# Altium project 3s2p battery pack.PrjPcb
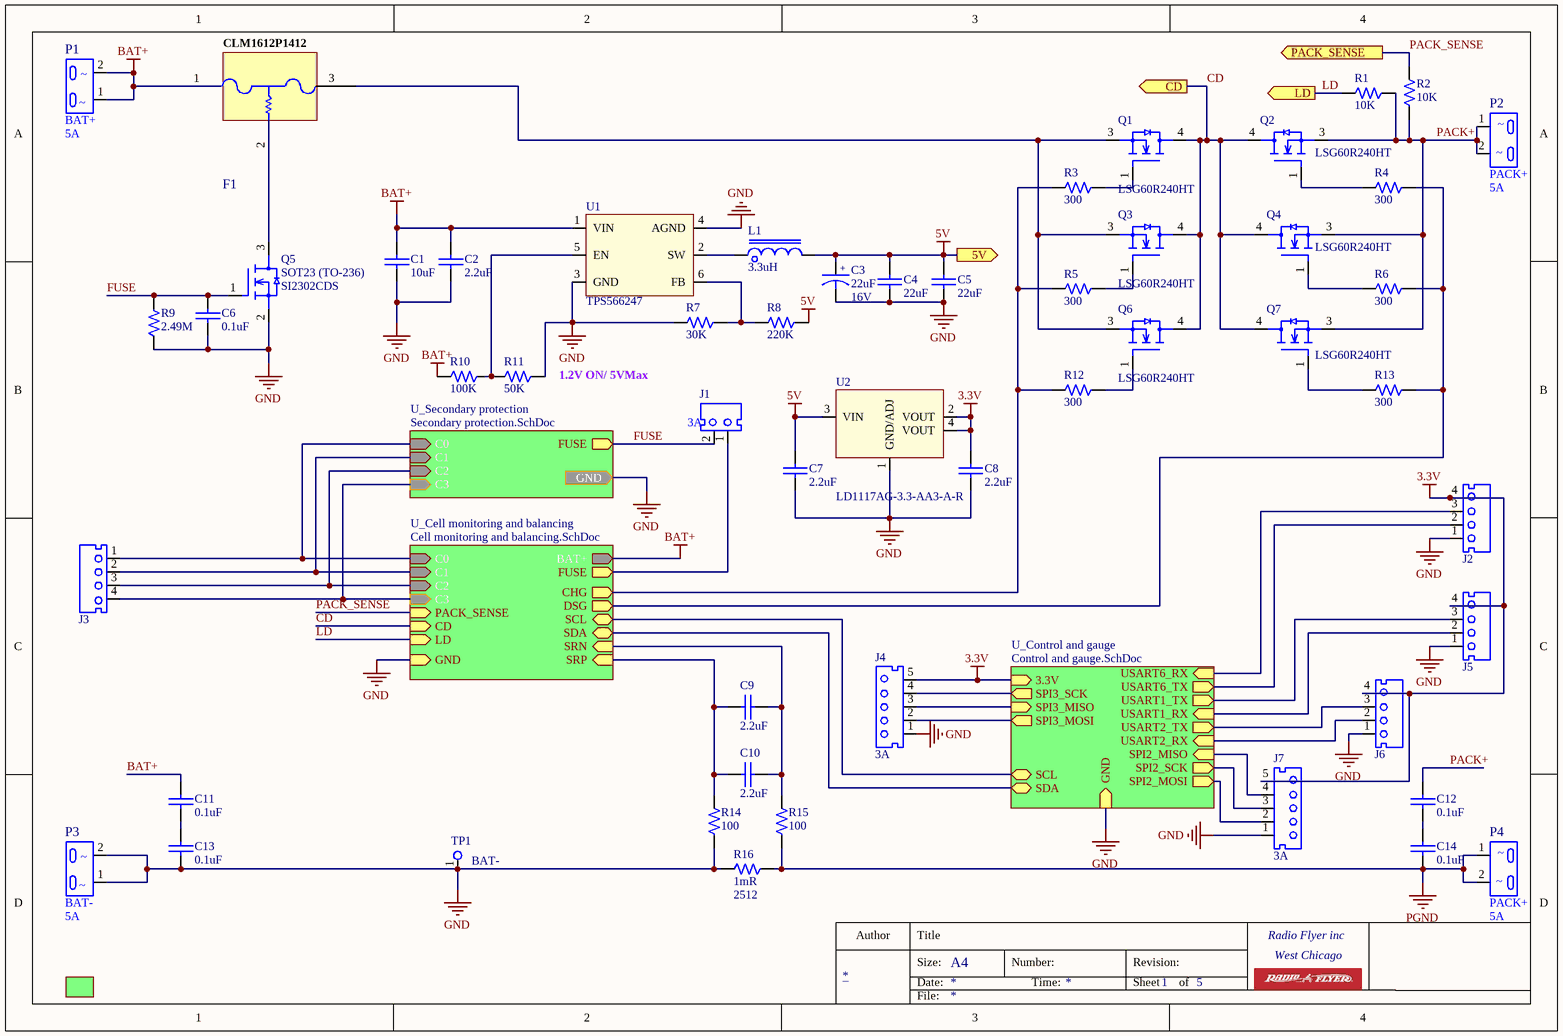
[diagram p0: Overview.SchDoc]
5 sheets, 112 parts. Net scope: hierarchical (ports join the sheet entries above them; power ports are global).
Board file: 3s2p battery pack.PcbDoc
Sheets:
  Overview.SchDoc
    U_Secondary protection = Secondary protection.SchDoc
    U_Cell monitoring and balancing = Cell monitoring and balancing.SchDoc
    U_Control and gauge = Control and gauge.SchDoc
    U_Main board frame = Main board frame.SchDoc

## Sheet Overview.SchDoc
size A4; Organization: Altium Limited; Address1: L3, 12a Rodborough Rd; Address2: Frenchs Forest; Address3: NSW; Address4: Australia 2086; SheetNumber: 1; SheetTotal: 5

### Parts
C1  value 10uF  [CAPC0603-RW]  (hidden comment: T542021037308)
C2  value 2.2uF  [CAPC0603-RW]  (hidden comment: T542021037308)
C3  value 22uF  Voltage: 16V  [CASE - B]  (hidden comment: T551220435010)
C4  value 22uF  [CAPC0603-RW]  (hidden comment: T542021037308)
C5  value 22uF  [CAPC0603-RW]  (hidden comment: T542021037308)
C6  value 0.1uF  [CAPC0603-RW]  (hidden comment: T542021037308)
C7  value 2.2uF  [CAPC0603-RW]  (hidden comment: T542021037308)
C8  value 2.2uF  [CAPC0603-RW]  (hidden comment: T542021037308)
C9  value 2.2uF  [CAPC0603-RW]  (hidden comment: T542021037308)
C10  value 2.2uF  [CAPC0603-RW]  (hidden comment: T542021037308)
C11  value 0.1uF  [CAPC0603-RW]  (hidden comment: T542021037308)
C12  value 0.1uF  [CAPC0603-RW]  (hidden comment: T542021037308)
C13  value 0.1uF  [CAPC0603-RW]  (hidden comment: T542021037308)
C14  value 0.1uF  [CAPC0603-RW]  (hidden comment: T542021037308)
F1  KED500004-0010  [CLM1612P1412]  (value not drawn)
J1  Current: 3A  [CONN 2P PH=2.5mm B2B-XH-A]  (hidden comment: CCN250000-0102)
J2  T690300164400  [CONN 4P PH=2.5mm 440052-4]  (value not drawn)
J3  T690300164400  [CONN 4P PH=2.5mm 440052-4]  (value not drawn)
J4  Current: 3A  [CONN 5P PH=2.5mm Molex 99-99-0989]  (hidden comment: CCN250001-0105)
J5  T690300164400  [CONN 4P PH=2.5mm 440052-4]  (value not drawn)
J6  T690300164400  [CONN 4P PH=2.5mm 440052-4]  (value not drawn)
J7  Current: 3A  [CONN 5P PH=2.5mm Molex 99-99-0989]  (hidden comment: CCN250001-0105)
L1  value 3.3uH  [IND  CKST0603]  (hidden comment: T621000080700)
P1  MFG Part: BAT+  Current: 5A  [AC INLET 2P DB8-6S1]  (hidden comment: CJP012009-0070)
P2  MFG Part: PACK+  Current: 5A  [AC INLET 2P DB8-6S1]  (hidden comment: CJP012009-0070)
P3  MFG Part: BAT-  Current: 5A  [AC INLET 2P DB8-6S1]  (hidden comment: CJP012009-0070)
P4  MFG Part: PACK+  Current: 5A  [AC INLET 2P DB8-6S1]  (hidden comment: CJP012009-0070)
Q1  MFG Part: LSG60R240HT  [TO252-3]  (hidden comment: T5860038503A6)
Q2  MFG Part: LSG60R240HT  [TO252-3]  (hidden comment: T5860038503A6)
Q3  MFG Part: LSG60R240HT  [TO252-3]  (hidden comment: T5860038503A6)
Q4  MFG Part: LSG60R240HT  [TO252-3]  (hidden comment: T5860038503A6)
Q5  Package: SOT23 (TO-236)  [SOT23-132-RW]  (hidden comment: SI2302CDS)
Q6  MFG Part: LSG60R240HT  [TO252-3]  (hidden comment: T5860038503A6)
Q7  MFG Part: LSG60R240HT  [TO252-3]  (hidden comment: T5860038503A6)
R1  value 10K  [0603-RW]  (hidden comment: T502976002399)
R2  value 10K  [0603-RW]  (hidden comment: T502976002399)
R3  value 300  [0603-RW]  (hidden comment: T502976002399)
R4  value 300  [0603-RW]  (hidden comment: T502976002399)
R5  value 300  [0603-RW]  (hidden comment: T502976002399)
R6  value 300  [0603-RW]  (hidden comment: T502976002399)
R7  value 30K  [0603-RW]  (hidden comment: T502976002399)
R8  value 220K  [0603-RW]  (hidden comment: T502976002399)
R9  value 2.49M  [0603-RW]  (hidden comment: T502976002399)
R10  value 100K  [0603-RW]  (hidden comment: T502976002399)
R11  value 50K  [0603-RW]  (hidden comment: T502976002399)
R12  value 300  [0603-RW]  (hidden comment: T502976002399)
R13  value 300  [0603-RW]  (hidden comment: T502976002399)
R14  value 100  [0603-RW]  (hidden comment: T502976002399)
R15  value 100  [0603-RW]  (hidden comment: T502976002399)
R16  value 1mR  [2512]  (hidden comment: QCF101250-1009)
TP1  BAT-  [RT-01T-1.0B]
U1  MFG Part: TPS566247  [SOT-563]  (hidden comment: CD1053GTF-Z)
U2  MFG Part: LD1117AG-3.3-AA3-A-R  [SOT223]  (hidden comment: T610600036508)

### Sub-sheets
U_Cell monitoring and balancing = Cell monitoring and balancing.SchDoc: BAT+ (out), C0 (in), C1 (in), C2 (in), C3 (in), PACK_SENSE (in), CD (in), FUSE (out), LD (in), SDA (bidir), SCL (bidir), CHG (out), DSG (out), SRN (in), SRP (in), GND (in)
U_Control and gauge = Control and gauge.SchDoc: SDA (bidir), SCL (bidir), 3.3V (in), USART6_RX (in), USART6_TX (out), USART1_TX (out), USART1_RX (in), SPI3_SCK (out), SPI3_MISO (in), USART2_RX (in), SPI3_MOSI (out), USART2_TX (out), SPI2_SCK (out), SPI2_MOSI (out), SPI2_MISO (in), GND (in)
U_Main board frame = Main board frame.SchDoc: no entries
U_Secondary protection = Secondary protection.SchDoc: C0 (in), C1 (in), C2 (in), C3 (in), FUSE (out)

### Ports
5V (out), CD (out), GND (in), LD (out), PACK_SENSE (out)

### Nets
3.3V: C8.1 J2.4 J4.5 J5.4 J6.4 J7.5 U2.2(VOUT) U2.4(VOUT) ; sheet U_Control and gauge/3.3V
5V: C3.1 C4.1 C5.1 C7.1 L1.2 R8.1 U2.3(VIN) ; port 5V
BAT+: C1.1 C2.1 C11.1 F1.1 J3.4 P1.1 P1.2 R10.2 U1.1(VIN) ; sheet U_Secondary protection/C3, sheet U_Cell monitoring and balancing/BAT+, sheet U_Cell monitoring and balancing/C3
GND: C1.2 C2.2 C3.2 C4.2 C5.2 C6.2 C7.2 C8.2 C13.2 J2.1 J3.1 J4.1 J5.1 J6.1 J7.1 P3.1 P3.2 Q5.2(S) R7.2 R9.2 R11.1 R14.1 R16.2 TP1.1 U1.3(GND) U1.4(AGND) U2.1(GND/ADJ) ; port GND, sheet U_Secondary protection/C0, sheet U_Cell monitoring and balancing/C0, sheet U_Cell monitoring and balancing/GND, sheet U_Control and gauge/GND
PGND: C14.2 P4.1 P4.2 R15.1 R16.1
CD: Q1.4(D) Q2.4(D) Q3.4(D) Q4.4(D) Q6.4(D) Q7.4(D) ; port CD, sheet U_Cell monitoring and balancing/CD
FUSE: C6.1 J1.2 Q5.1(G) R9.1 ; sheet U_Secondary protection/FUSE
LD: R1.2 ; port LD, sheet U_Cell monitoring and balancing/LD
PACK+: C12.1 P2.1 P2.2 Q2.3(S) Q4.3(S) Q7.3(S) R1.1 R2.1
PACK_SENSE: R2.2 ; port PACK_SENSE, sheet U_Cell monitoring and balancing/PACK_SENSE
NetC9_1: C9.1 C10.1 R15.2 ; sheet U_Cell monitoring and balancing/SRN
NetC9_2: C9.2 C10.2 R14.2 ; sheet U_Cell monitoring and balancing/SRP
NetC11_2: C11.2 C13.1
NetC12_2: C12.2 C14.1
NetF1_2: F1.2 Q5.3(D)
NetF1_3: F1.3 Q1.3(S) Q3.3(S) Q6.3(S)
NetJ1_1: J1.1 ; sheet U_Cell monitoring and balancing/FUSE
NetJ2_2: J2.2 ; sheet U_Control and gauge/USART6_TX
NetJ2_3: J2.3 ; sheet U_Control and gauge/USART6_RX
NetJ3_2: J3.2 ; sheet U_Secondary protection/C1, sheet U_Cell monitoring and balancing/C1
NetJ3_3: J3.3 ; sheet U_Secondary protection/C2, sheet U_Cell monitoring and balancing/C2
NetJ4_2: J4.2 ; sheet U_Control and gauge/SPI3_MOSI
NetJ4_3: J4.3 ; sheet U_Control and gauge/SPI3_MISO
NetJ4_4: J4.4 ; sheet U_Control and gauge/SPI3_SCK
NetJ5_2: J5.2 ; sheet U_Control and gauge/USART1_RX
NetJ5_3: J5.3 ; sheet U_Control and gauge/USART1_TX
NetJ6_2: J6.2 ; sheet U_Control and gauge/USART2_RX
NetJ6_3: J6.3 ; sheet U_Control and gauge/USART2_TX
NetJ7_2: J7.2 ; sheet U_Control and gauge/SPI2_MOSI
NetJ7_3: J7.3 ; sheet U_Control and gauge/SPI2_SCK
NetJ7_4: J7.4 ; sheet U_Control and gauge/SPI2_MISO
NetL1_1: L1.1 U1.2(SW)
NetQ1_1: Q1.1(G) R3.1
NetQ2_1: Q2.1(G) R4.2
NetQ3_1: Q3.1(G) R5.1
NetQ4_1: Q4.1(G) R6.2
NetQ6_1: Q6.1(G) R12.1
NetQ7_1: Q7.1(G) R13.2
NetR3_2: R3.2 R5.2 R12.2 ; sheet U_Cell monitoring and balancing/CHG
NetR4_1: R4.1 R6.1 R13.1 ; sheet U_Cell monitoring and balancing/DSG
NetR7_1: R7.1 R8.2 U1.6(FB)
NetR10_1: R10.1 R11.2 U1.5(EN)
NetR29_2: sheet U_Cell monitoring and balancing/SCL, sheet U_Control and gauge/SCL
NetR30_2: sheet U_Cell monitoring and balancing/SDA, sheet U_Control and gauge/SDA

### Notes on the sheet
- (near R11) 1.2V ON/ 5VMax
- Author
- Title
- Size:
- Date:
- A4
- Number:
- Time:
- Revision:
- Sheet
- of
- Radio Flyer inc
- West Chicago
- File:
- (in symbol AC INLET 2P DB8-6S1 Polar) ~
- (in symbol CAP E 22uF 16V 20% SMD_VEJ220M1CTR-0405) +

### Library data of the parts
C1 C2 C4-C14 = CAP0603 0.01uF 16V 10%_X7R_WALSIN: CAP X7R .01UF 16V +-10% 0603 WALSIN L; Tolerance: 10%; Type: Capacitor; CREATE_NAME: Nathan; DIP&SMD: SMD; SAP: T542021037308; PACKAGE: CAPC0603; Vendor Name: *; MFG: WALSIN; MFG Part: *; Other: X7R; CREATE_TIME: 13-July-2016; Customer Specific: N/A; Voltage: 16V
C3 = CAP E 22uF 16V 20% SMD_VEJ220M1CTR-0405: E 22UF 16V +-20% 4.3X4. VEJ220M1C K; MFG: LELON; Type: Capacitor; CREATE_NAME: Nathan; DIP&SMD: SMD; SAP: T551220435010; MFG Part: VEJ220M1CTR-0405; Other: *; CREATE_TIME: 01-Mar-2019; Customer Specific: N/A; PACKAGE: CASE - B
F1 = CLM1612P1412: 3 Terminal Fuse 12A 3S; MFG Part: YG212-12031; SAP: T575009990164; MFG: XIAMEN G&P; Type: LED; CREATE_NAME: Tom; DIP&SMD: DIP; Vendor Name: *; Vendor Code: *; CREATE_TIME: 14-Apr-2015
J1 = CONN 2P PH=2.5mm B2B-XH-A: GP CONNECTOR B2B-XH-A 2 PIN G; MFG Part: HAA250A-2A-WHITE; Value: 2.5mm; SAP: T690300041200; MFG: 金瑞康; Vendor Name: 亿源电子有限公司; Vendor Code: 10009989; DIP&SMD: DIP; Type: Connector
J2 J3 J5 J6 = CONN 4P PH=2.5mm 440052-4_TE: GP CONNECTOR B4B-XH-A 4 PIN; Value: 2.5mm; MFG: TE; DIP&SMD: DIP; CREATE_NAME: Nathan; SAP: T690300164400; MFG Part: 440052-4; Vendor Name: *; Vendor Code: *; Type: Connector; CREATE_TIME: 10-APR-2019; Current: *
J4 J7 = CONN 5P PH=2.5mm Molex 99-99-0989: CONNECTOR 5PIN P=2.5mm 180'; Value: 2.5mm; SAP: T690300024200; MFG: Molex; CREATE_NAME: Nathan; DIP&SMD: DIP; MFG Part: 99-99-0989; Vendor Name: *; Vendor Code: *; Type: Connector; CREATE_TIME: 10-Feb-2015
L1 = IND 3.3uH CKST0603-3.3UH\M: 3.3UH 6A 100K SMD CENKER CKST060 K; Type: INDUCTOR; CREATE_NAME: Nathan; DCR: 26mohm; Isat: 9.5A; SAP: T621000080700; MFG: CENKER; Vendor Code: *; Vendor Name: *; CREATE_TIME: 13-Mar-2019; Irms: 6A; MFG Part: CKST0603-3.3UH\M; DIP&SMD: SMD
P1-P4 = AC INLET 2P DB8-6S1 Polar: AC SOCKET 2P D2.36 2.5A 250V VDE BLACK; SAP: T690300011600; MFG: 金明浩; Vendor Name: 深圳市金明浩电子科技有限公司; Vendor Code: 10010007; DIP&SMD: DIP; Value: *; Type: Connector
Q1-Q4 Q6 Q7 = NMOS LSG60R240HT: NMOS 600V LSG60R240HT TO252( LONTEN K; Current: 17A; Type: N-CHANNEL MOSFET; CREATE_NAME: Nathan; DIP&SMD: SMD; SAP: T5860038503A6; Pd: *; Vendor Code: *; Vendor Name: *; Voltage: 600V; MFG: LONTEN; CREATE_TIME: 12-Oct-2019; Rds: *; Customer Specific: N/A; Package: TO252
Q5 = SI2302CDS: NMOS FET-Si2302CDS; MFG: VISHAY; CREATE_NAME: Nathan; DIP&SMD: SMD; SAP: *; Power: *; Vendor Code: *; Vendor Name: *; Voltage: *; Current: *; Type: NMOS; CREATE_TIME: 17-Nov-2020; Customer Specific: N/A; MFG Part: SI2302CDS
R1-R15 = RES0603 1/10W +-1% 976 OHM 100PPM: CHIP 976 OHM 100PPM +-1% 0603 WALS L; Power: 0.1W; MFG: WALSIN; CREATE_NAME: Tom; DIP&SMD: SMD; Vendor Code: *; SAP: T502976002399; Vendor Name: *; MFG Part: *; Type: Resistor; CREATE_TIME: 17-Dec-2015; PACKAGE: 0603; TOL: +-1%; Customer Specific: N/A
R16 = RES2512 1W 1% 10 OHM: CHIP RES. 10 OHM 1W 1% 2512; Vendor Code: 10010262; SAP: T502100A07399; Vendor Name: 东莞市晴远电子有限公司; DIP&SMD: SMD; Power: 1W; MFG Part: *; MFG: *; TOL: 1%; Type: Resistor; Customer Specific: N/A; PACKAGE: 2512
TP1 = TERMINAL RT-01T-1.0B: TERMINAL 11MM G; CREATE_NAME: Nathan; SAP: T690300035900; MFG: 利民豐（JST); DIP&SMD: DIP; MFG Part: RT-01T-1.0B; Vendor Name: *; Vendor code: *; Type: *; Package: *; CREATE_TIME: 07-July-2016
U1 = CD1053GTF-Z: MFG: MPS; CREATE_NAME: Nathan; DIP&SMD: SMD; SAP: *; Vendor Code: *; Vendor Name: *; Package: SOT-563; CREATE_TIME: 13-Jun-2020; Customer Specific: N/A
U2 = LD1117AG-3.3-AA3-A-R_101: REG LD1117AG-3.3-AA3- SOT223 UTC L; CREATE_NAME: Tom; DIP&SMD: SMD; MFG: UTC; Vendor Code: *; Vendor Name: *; SAP: T610600036508; Type: IC; CREATE_TIME: 23-Apr-2019; Customer Specific: N/A

## Sheet Secondary protection.SchDoc
size A4; SheetNumber: 5; SheetTotal: 5
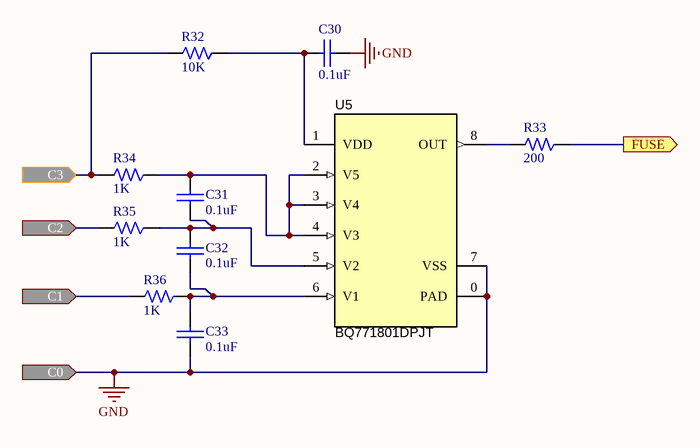
[diagram p1: Secondary protection.SchDoc]

### Parts
C30  value 0.1uF  [CAPC0603-RW]  (hidden comment: T542021037308)
C31  value 0.1uF  [CAPC0603-RW]  (hidden comment: T542021037308)
C32  value 0.1uF  [CAPC0603-RW]  (hidden comment: T542021037308)
C33  value 0.1uF  [CAPC0603-RW]  (hidden comment: T542021037308)
R32  value 10K  [0603-RW]  (hidden comment: T502976002399)
R33  value 200  [0603-RW]  (hidden comment: T502976002399)
R34  value 1K  [0603-RW]  (hidden comment: T502976002399)
R35  value 1K  [0603-RW]  (hidden comment: T502976002399)
R36  value 1K  [0603-RW]  (hidden comment: T502976002399)
U5  BQ771801DPJT  [WSON(6x5x0.8)]

### Ports
C0 (in), C1 (in), C2 (in), C3 (in), FUSE (out)

### Nets
BAT+: R32.2 R34.2 ; port C3
GND: C30.2 C33.2 U5.0(PAD) U5.7(VSS) ; port C0
FUSE: R33.1 ; port FUSE
NetC30_1: C30.1 R32.1 U5.1(VDD)
NetC31_1: C31.1 R34.1 U5.2(V5) U5.3(V4) U5.4(V3)
NetC31_2: C31.2 C32.1 R35.1 U5.5(V2)
NetC32_2: C32.2 C33.1 R36.1 U5.6(V1)
NetJ3_2: R36.2 ; port C1
NetJ3_3: R35.2 ; port C2
NetR33_2: R33.2 U5.8(OUT)

### Notes on the sheet
- Author
- Title
- Size:
- Date:
- A4
- Number:
- Time:
- Revision:
- Sheet
- of
- Radio Flyer inc
- West Chicago
- File:

### Library data of the parts
C30-C33 = CAP0603 0.01uF 16V 10%_X7R_WALSIN: as C1 on sheet Overview; SAP: T542021037308; PACKAGE: CAPC0603; Vendor Name: *; MFG: WALSIN; MFG Part: *; Other: X7R; CREATE_TIME: 13-July-2016; Customer Specific: N/A; Voltage: 16V
R32-R36 = RES0603 1/10W +-1% 976 OHM 100PPM: as R1 on sheet Overview; Vendor Code: *; SAP: T502976002399; Vendor Name: *; MFG Part: *; Type: Resistor; CREATE_TIME: 17-Dec-2015; PACKAGE: 0603; TOL: +-1%; Customer Specific: N/A
U5 = CMP-0078897-2: Family 2-5S Overvoltage Protector with Internal Delay Timer, DPJ0008A (WSON-8); Alternate PartNumber: BQ771801DPJR; Alternate Manufacturer: Texas Instruments; SizeAreaWB_mm2: 20; SizeZ_mm: 0.8; SizeX_mm: 4; SizeY_mm: 3; SizeArea_mm2: 12; CompType: IC; AEC Qualified: N; AEC Category: Q200; ComponentLink1URL: http://www.ti.com/lit/ds/symlink/bq7718.pdf; PackageDescription: WSON-8; RoHS: Y; MountType: SMT; ComponentLink2URL: http://www.ti.com/product/bq7718; ComponentLink2Description: Product Folder; Manufacturer: Texas Instruments; PackageReference: DPJ0008A; PartNumber: BQ771801DPJT; ComponentLink1Description: Datasheet Link

## Sheet Cell monitoring and balancing.SchDoc
size A4; Organization: Altium Limited; Address1: L3, 12a Rodborough Rd; Address2: Frenchs Forest; Address3: NSW; Address4: Australia 2086; SheetNumber: 3; SheetTotal: 5
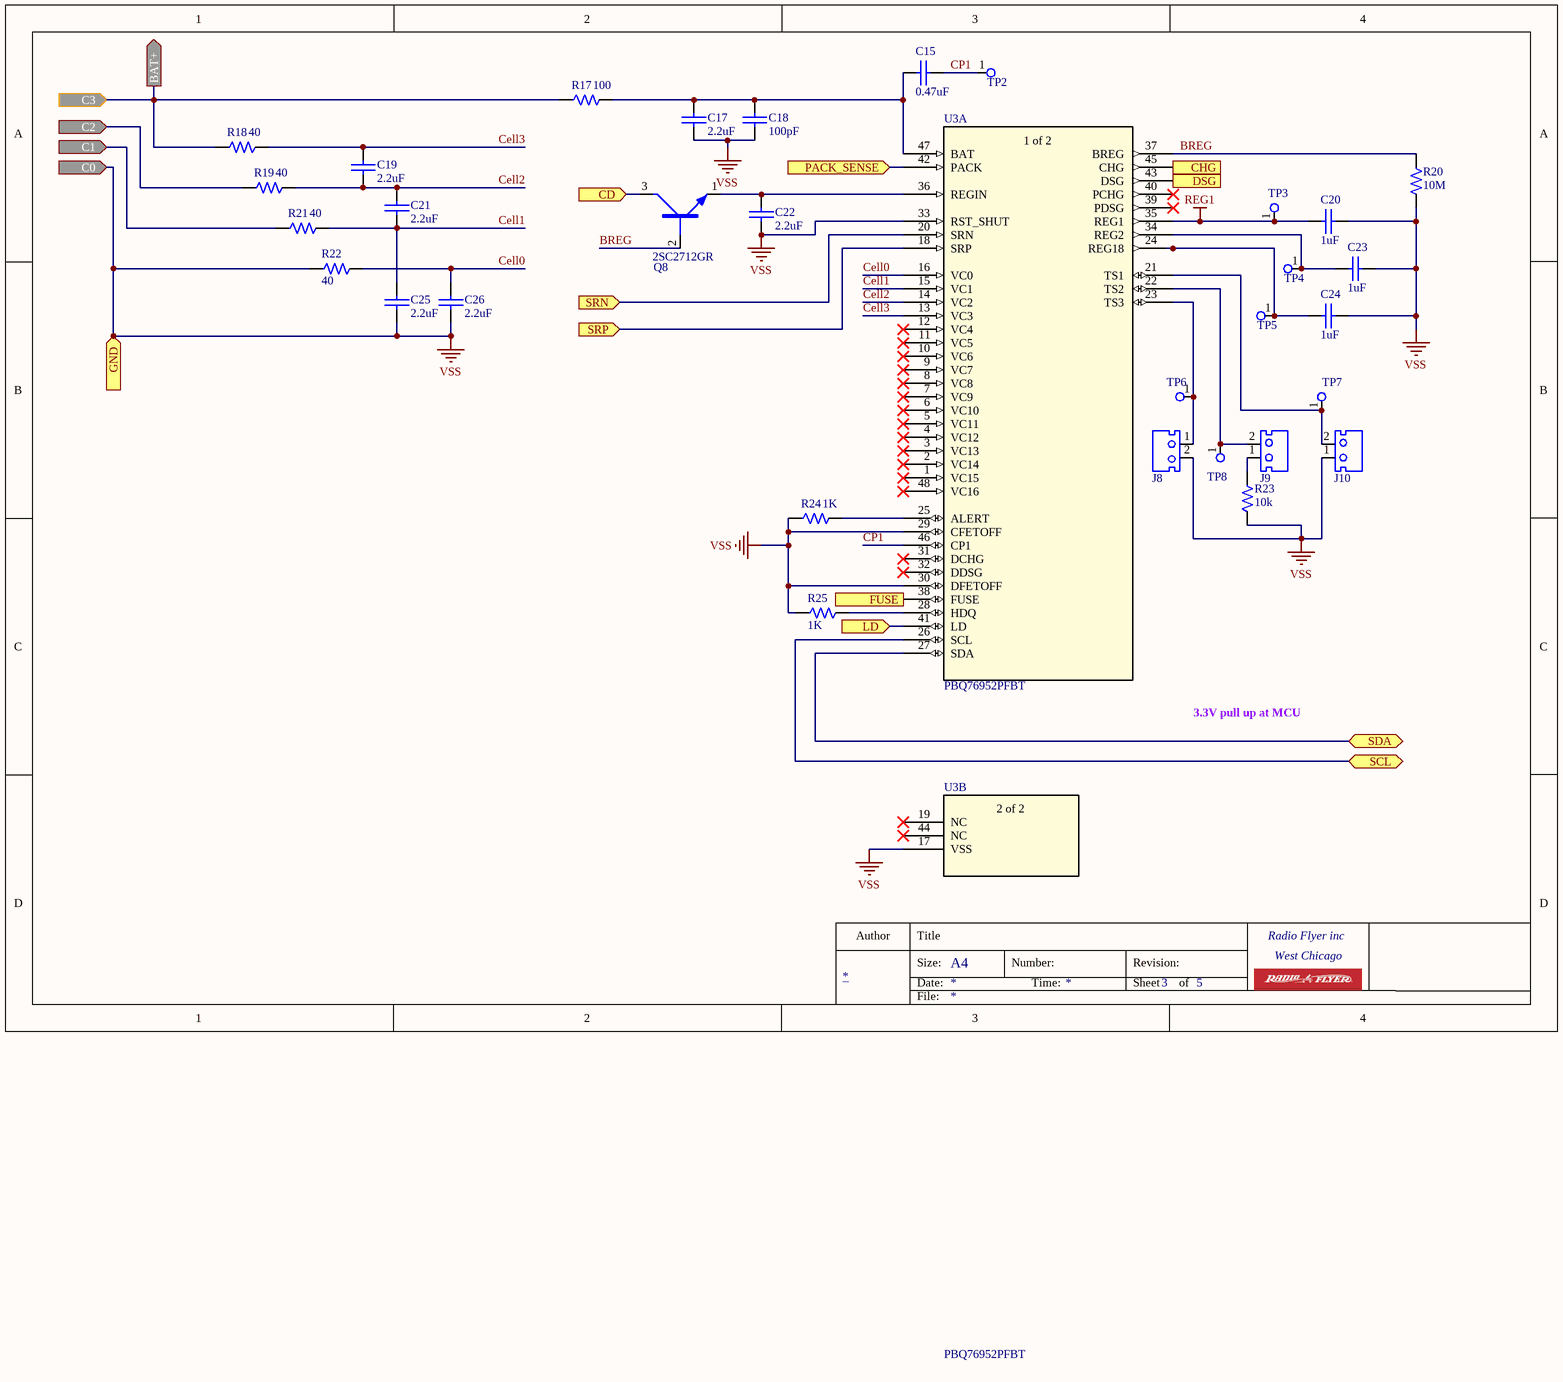
[diagram p2: Cell monitoring and balancing.SchDoc]

### Parts
C15  value 0.47uF  [CAPC0603-RW]  (hidden comment: T542021037308)
C17  value 2.2uF  [CAPC0603-RW]  (hidden comment: T542021037308)
C18  value 100pF  [CAPC0603-RW]  (hidden comment: T542021037308)
C19  value 2.2uF  [CAPC0603-RW]  (hidden comment: T542021037308)
C20  value 1uF  [CAPC0603-RW]  (hidden comment: T542021037308)
C21  value 2.2uF  [CAPC0603-RW]  (hidden comment: T542021037308)
C22  value 2.2uF  [CAPC0603-RW]  (hidden comment: T542021037308)
C23  value 1uF  [CAPC0603-RW]  (hidden comment: T542021037308)
C24  value 1uF  [CAPC0603-RW]  (hidden comment: T542021037308)
C25  value 2.2uF  [CAPC0603-RW]  (hidden comment: T542021037308)
C26  value 2.2uF  [CAPC0603-RW]  (hidden comment: T542021037308)
J8  CCN250002-0102  [CONN 2P PH=2.5mm HAA250A-2 RED]  (value not drawn)
J9  CCN250002-0102  [CONN 2P PH=2.5mm HAA250A-2 RED]  (value not drawn)
J10  CCN250002-0102  [CONN 2P PH=2.5mm HAA250A-2 RED]  (value not drawn)
Q8  T5810040804A0  [2SC2712GR]  (value not drawn)
R17  value 100  [0603-RW]  (hidden comment: T502976002399)
R18  value 40  [0603-RW]  (hidden comment: T502976002399)
R19  value 40  [0603-RW]  (hidden comment: T502976002399)
R20  value 10M  [0603-RW]  (hidden comment: T502976002399)
R21  value 40  [0603-RW]  (hidden comment: T502976002399)
R22  value 40  [0603-RW]  (hidden comment: T502976002399)
R23  value 10k  [0603-RW]  (hidden comment: T502976002399)
R24  value 1K  [0603-RW]  (hidden comment: T502976002399)
R25  value 1K  [0603-RW]  (hidden comment: T502976002399)
TP2  CP1  [RT-01T-1.0B]  (value not drawn)
TP3  CP1  [RT-01T-1.0B]  (value not drawn)
TP4  CP1  [RT-01T-1.0B]  (value not drawn)
TP5  CP1  [RT-01T-1.0B]  (value not drawn)
TP6  CP1  [RT-01T-1.0B]  (value not drawn)
TP7  CP1  [RT-01T-1.0B]  (value not drawn)
TP8  CP1  [RT-01T-1.0B]  (value not drawn)
U3  PBQ76952PFBT  [PFB48_TEX]  (parts A,B of 2)

### Ports
BAT+ (out), C0 (in), C1 (in), C2 (in), C3 (in), CD (in), CHG (out), DSG (out), FUSE (out), GND (in), LD (in), PACK_SENSE (in), SCL (bidir), SDA (bidir), SRN (in), SRP (in)

### Nets
BAT+: R17.1 R18.1 ; port BAT+, port C3
REG1: C20.2 TP3.1 U3.35(REG1)
VSS: C17.1 C18.1 C20.1 C22.1 C23.1 C24.1 C25.1 C26.1 J8.2 J10.1 R20.2 R22.1 R23.2 R24.1 R25.1 U3.17(VSS) U3.29(CFETOFF) U3.30(DFETOFF) U3.33(RST_SHUT) ; port C0, port GND  [project net GND]
BREG: Q8.2(B) R20.1 U3.37(BREG)
CD: Q8.3(C) ; port CD
Cell0: C26.2 R22.2 U3.16(VC0)
Cell1: C21.1 C25.2 R21.2 U3.15(VC1)
Cell2: C19.1 C21.2 R19.2 U3.14(VC2)
Cell3: C19.2 R18.2 U3.13(VC3)
CP1: C15.1 TP2.1 U3.46(CP1)
LD: U3.41(LD) ; port LD
PACK_SENSE: U3.42(PACK) ; port PACK_SENSE
NetC9_1: U3.20(SRN) ; port SRN
NetC9_2: U3.18(SRP) ; port SRP
NetC15_2: C15.2 C17.2 C18.2 R17.2 U3.47(BAT)
NetC22_2: C22.2 Q8.1(E) U3.36(REGIN)
NetC23_2: C23.2 TP4.1 U3.34(REG2)
NetC24_2: C24.2 TP5.1 U3.24(REG18)
NetJ1_1: U3.38(FUSE) ; port FUSE
NetJ3_2: R21.1 ; port C1
NetJ3_3: R19.1 ; port C2
NetJ8_1: J8.1 TP6.1 U3.23(TS3)
NetJ9_1: J9.1 R23.1
NetJ9_2: J9.2 TP8.1 U3.22(TS2)
NetJ10_2: J10.2 TP7.1 U3.21(TS1)
NetR3_2: U3.45(CHG) ; port CHG
NetR4_1: U3.43(DSG) ; port DSG
NetR24_2: R24.2 U3.25(ALERT)
NetR25_2: R25.2 U3.28(HDQ)
NetR29_2: U3.26(SCL) ; port SCL
NetR30_2: U3.27(SDA) ; port SDA

Not connected (* = marked no-connect by the designer): U3 1(VC15)* 2(VC14)* 3(VC13)* 4(VC12)* 5(VC11)* 6(VC10)* 7(VC9)* 8(VC8)* 9(VC7)* 10(VC6)* 11(VC5)* 12(VC4)* 19(NC)* 31(DCHG)* 32(DDSG)* 39(PDSG)* 40(PCHG)* 44(NC)* 48(VC16)*

### Notes on the sheet
- 3.3V pull up at MCU
- Author
- Title
- Size:
- Date:
- A4
- Number:
- Time:
- Revision:
- Sheet
- of
- Radio Flyer inc
- West Chicago
- File:
- (in symbol PBQ76952PFBT, part A) 1 of 2
- (in symbol PBQ76952PFBT, part B) 2 of 2

### Library data of the parts
C15 C17-C26 = CAP0603 0.01uF 16V 10%_X7R_WALSIN: as C1 on sheet Overview; SAP: T542021037308; PACKAGE: CAPC0603; Vendor Name: *; MFG: WALSIN; MFG Part: *; Other: X7R; CREATE_TIME: 13-July-2016; Customer Specific: N/A; Voltage: 16V
J8-J10 = CONN 2P PH=2.5mm HAA250A-2 RED: CONNECTOR HA2.5 2PIN RED G; Value: 2.5mm; SAP: T690300024700; MFG: 金瑞康; CREATE_NAME: Nathan; Current: 3A; DIP&SMD: DIP; MFG Part: HAA250A-2 RED; Vendor Name: *; Vendor Code: *; Type: Connector; CREATE_TIME: 15-June-2016
Q8 = 2SC2712GR: NPN 50V 2SC2712GR SOT23 BLUE R K; MFG: BLUE ROCKET(藍箭電子); Current: 0.15A; CREATE_NAME: Nathan; DIP&SMD: SMD; SAP: T5810040804A0; Vendor Code: *; Vendor Name: *; Power: *; Voltage: 50V; Type: NPN; CREATE_TIME: 14-July-2017; Package: SOT23 (SC-59 SST3); Customer Specific: N/A; MFG Part: 2SC2712GR
R17-R25 = RES0603 1/10W +-1% 976 OHM 100PPM: as R1 on sheet Overview; Vendor Code: *; SAP: T502976002399; Vendor Name: *; MFG Part: *; Type: Resistor; CREATE_TIME: 17-Dec-2015; PACKAGE: 0603; TOL: +-1%; Customer Specific: N/A
TP2-TP8 = TERMINAL RT-01T-1.0B: as TP1 on sheet Overview; MFG Part: RT-01T-1.0B; Vendor Name: *; Vendor code: *; Type: *; Package: *; CREATE_TIME: 07-July-2016
U3 = PBQ76952PFBT: No Description Available; Mfr_Name: Texas Instruments; RefDes: RefDes; Type: Type

## Sheet Control and gauge.SchDoc
size A4; Organization: Altium Limited; Address1: L3, 12a Rodborough Rd; Address2: Frenchs Forest; Address3: NSW; Address4: Australia 2086; SheetNumber: 4; SheetTotal: 5
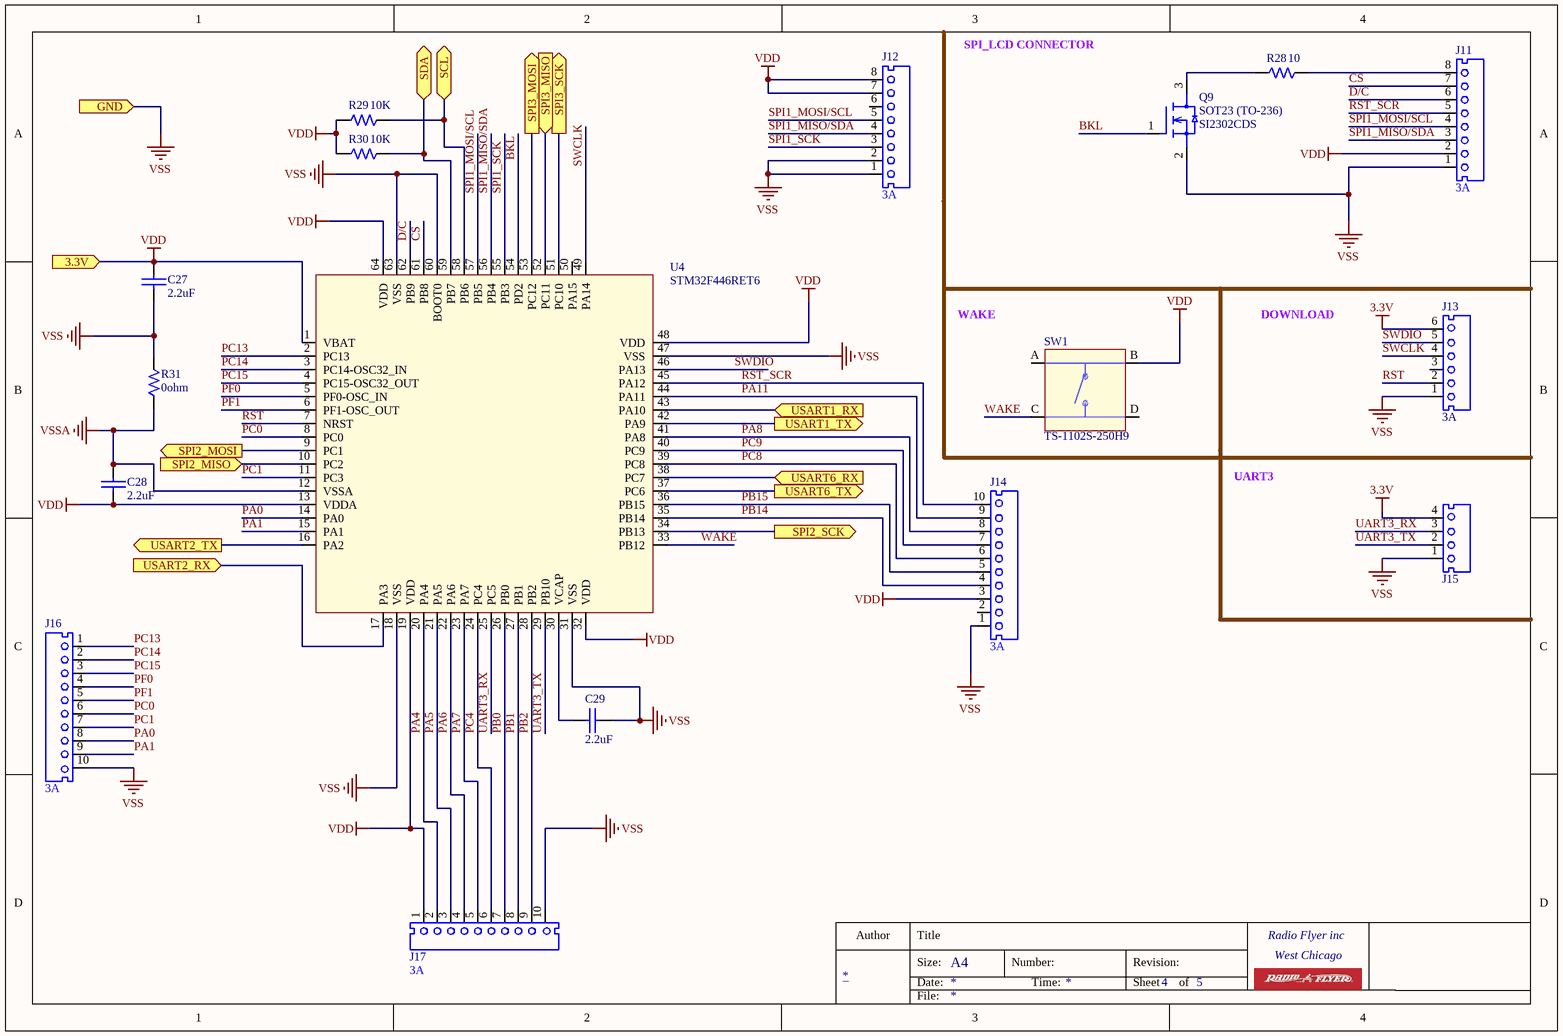
[diagram p3: Control and gauge.SchDoc]

### Parts
C27  value 2.2uF  [CAPC0603-RW]  (hidden comment: T542021037308)
C28  value 2.2uF  [CAPC0603-RW]  (hidden comment: T542021037308)
C29  value 2.2uF  [CAPC0603-RW]  (hidden comment: T542021037308)
J11  Current: 3A  [CONN 8P PH=2.5 ST TJC3-8A-CS]  (hidden comment: T690300135100)
J12  Current: 3A  [CONN 8P PH=2.5 ST TJC3-8A-CS]  (hidden comment: T690300135100)
J13  Current: 3A  [CONN 6P PH=2.5mm B6B-XH-A]  (hidden comment: CCN250000-0106)
J14  Current: 3A  [CONN 10P PH=2.5 ST TJC3-10A-CS]  (hidden comment: T690300163300)
J15  T690300164400  [CONN 4P PH=2.5mm 440052-4]  (value not drawn)
J16  Current: 3A  [CONN 10P PH=2.5 ST TJC3-10A-CS]  (hidden comment: T690300163300)
J17  Current: 3A  [CONN 10P PH=2.5 ST TJC3-10A-CS]  (hidden comment: T690300163300)
Q9  Package: SOT23 (TO-236)  [SOT23-132-RW]  (hidden comment: SI2302CDS)
R28  value 10  [0603-RW]  (hidden comment: T502976002399)
R29  value 10K  [0603-RW]  (hidden comment: T502976002399)
R30  value 10K  [0603-RW]  (hidden comment: T502976002399)
R31  value 0ohm  [0603-RW]  (hidden comment: T502976002399)
SW1  MFG Part: TS-1102S-250H9  [TACT SW TS-1102S-250H9]  (hidden comment: T670200014500)
U4  MFG Part: STM32F446RET6  [QFP50P1200X1200X160-64N]  (hidden comment: T610300097225)

### Ports
3.3V (in), GND (in), SCL (bidir), SDA (bidir), SPI2_MISO (in), SPI2_MOSI (out), SPI2_SCK (out), SPI3_MISO (in), SPI3_MOSI (out), SPI3_SCK (out), USART1_RX (in), USART1_TX (out), USART2_RX (in), USART2_TX (out), USART6_RX (in), USART6_TX (out)

### Nets
3.3V: C27.2 C28.1 J11.2 J12.7 J12.8 J13.6 J14.3 J15.4 J17.1 R29.1 R30.1 SW1.B U4.1(VBAT) U4.13(VDDA) U4.19(VDD) U4.32(VDD) U4.48(VDD) U4.64(VDD) ; port 3.3V  [also labelled VDD]
VSS: C27.1 C29.1 J11.1 J12.1 J12.2 J13.1 J14.1 J15.1 J16.10 J17.10 Q9.2(S) R31.2 U4.18(VSS) U4.31(VSS) U4.47(VSS) U4.60(BOOT0) U4.63(VSS) ; port GND  [project net GND]
VSSA: C28.2 R31.1 U4.12(VSSA)
BKL: Q9.1(G) U4.54(PD2)
CS: J11.7 U4.61(PB8)
D/C: J11.6 U4.62(PB9)
PA0: J16.8 U4.14(PA0)
PA1: J16.9 U4.15(PA1)
PA4: J17.2 U4.20(PA4)
PA5: J17.3 U4.21(PA5)
PA6: J17.4 U4.22(PA6)
PA7: J17.5 U4.23(PA7)
PA8: J14.8 U4.41(PA8)
PA11: J14.9 U4.44(PA11)
PB0: J17.7 U4.26(PB0)
PB1: J17.8 U4.27(PB1)
PB2: J17.9 U4.28(PB2)
PB14: J14.4 U4.35(PB14)
PB15: J14.5 U4.36(PB15)
PC0: J16.6 U4.8(PC0)
PC1: J16.7 U4.11(PC3)
PC4: J17.6 U4.24(PC4)
PC8: J14.6 U4.39(PC8)
PC9: J14.7 U4.40(PC9)
PC13: J16.1 U4.2(PC13)
PC14: J16.2 U4.3(PC14-OSC32_IN)
PC15: J16.3 U4.4(PC15-OSC32_OUT)
PF0: J16.4 U4.5(PF0-OSC_IN)
PF1: J16.5 U4.6(PF1-OSC_OUT)
RST: J13.2 U4.7(NRST)
RST_SCR: J11.5 J14.10 U4.45(PA12)
SPI1_MISO/SDA: J11.3 J12.4 U4.56(PB4)
SPI1_MOSI/SCL: J11.4 J12.5 U4.57(PB5)
SPI1_SCK: J12.3 U4.55(PB3)
SWCLK: J13.4 U4.49(PA14)
SWDIO: J13.5 U4.46(PA13)
UART3_RX: J15.3 U4.25(PC5)
UART3_TX: J15.2 U4.29(PB10)
WAKE: SW1.C U4.33(PB12)
NetC29_2: C29.2 U4.30(VCAP)
NetJ2_2: U4.37(PC6) ; port USART6_TX
NetJ2_3: U4.38(PC7) ; port USART6_RX
NetJ4_2: U4.53(PC12) ; port SPI3_MOSI
NetJ4_3: U4.52(PC11) ; port SPI3_MISO
NetJ4_4: U4.51(PC10) ; port SPI3_SCK
NetJ5_2: U4.43(PA10) ; port USART1_RX
NetJ5_3: U4.42(PA9) ; port USART1_TX
NetJ6_2: U4.17(PA3) ; port USART2_RX
NetJ6_3: U4.16(PA2) ; port USART2_TX
NetJ7_2: U4.9(PC1) ; port SPI2_MOSI
NetJ7_3: U4.34(PB13) ; port SPI2_SCK
NetJ7_4: U4.10(PC2) ; port SPI2_MISO
NetJ11_8: J11.8 R28.2
NetQ9_3: Q9.3(D) R28.1
NetR29_2: R29.2 U4.58(PB6) ; port SCL
NetR30_2: R30.2 U4.59(PB7) ; port SDA

Not connected (* = marked no-connect by the designer): J12 6; J13 3; J14 2; SW1 A D; U4 50(PA15)

### Notes on the sheet
- SPI_LCD CONNECTOR
- WAKE
- DOWNLOAD
- UART3
- Author
- Title
- Size:
- Date:
- A4
- Number:
- Time:
- Revision:
- Sheet
- of
- Radio Flyer inc
- West Chicago
- File:

### Library data of the parts
C27-C29 = CAP0603 0.01uF 16V 10%_X7R_WALSIN: as C1 on sheet Overview; SAP: T542021037308; PACKAGE: CAPC0603; Vendor Name: *; MFG: WALSIN; MFG Part: *; Other: X7R; CREATE_TIME: 13-July-2016; Customer Specific: N/A; Voltage: 16V
J11 J12 = CONN 8P PH=2.5 ST TJC3-8A-CS: CONN 8PIN P2.5 M\180 TJC3-8A-CS K; Value: 2.5mm; MFG: JINJIA; CREATE_NAME: Nathan; DIP&SMD: DIP; SAP: T690300135100; MFG Part: TJC3-8A-CS; Vendor Name: *; Vendor Code: *; Type: Connector; CREATE_TIME: 21-Mar-2018
J13 = CONN 6P PH=2.5mm B6B-XH-A: GP CONNECTOR B6B-XH-A 6 PIN; Value: 2.5mm; SAP: T690300041300; Vendor Name: 亿源电子有限公司; Vendor Code: 10009989; DIP&SMD: DIP; MFG: *; MFG Part: *; Type: Connector
J14 J16 J17 = CONN 10P PH=2.5 ST TJC3-10A-CS: CONN 10PIN P2.5 M\180 TJC3-10A-CS K; Value: 2.5mm; MFG: JINJIA; CREATE_NAME: Nathan; DIP&SMD: DIP; SAP: T690300163300; MFG Part: TJC3-10A-CS; Vendor Name: *; Vendor Code: *; Type: Connector; CREATE_TIME: 19-Mar-2019
J15 = CONN 4P PH=2.5mm 440052-4_TE: as J2 on sheet Overview; SAP: T690300164400; MFG Part: 440052-4; Vendor Name: *; Vendor Code: *; Type: Connector; CREATE_TIME: 10-APR-2019; Current: *
Q9 = SI2302CDS: as Q5 on sheet Overview; SAP: *; Power: *; Vendor Code: *; Vendor Name: *; Voltage: *; Current: *; Type: NMOS; CREATE_TIME: 17-Nov-2020; Customer Specific: N/A; MFG Part: SI2302CDS
R28-R31 = RES0603 1/10W +-1% 976 OHM 100PPM: as R1 on sheet Overview; Vendor Code: *; SAP: T502976002399; Vendor Name: *; MFG Part: *; Type: Resistor; CREATE_TIME: 17-Dec-2015; PACKAGE: 0603; TOL: +-1%; Customer Specific: N/A
SW1 = TACT SW TS-1102S-250H9: TACT SW TS-1102S-250H9 JINGJU K; Current: 50mA; Voltage: 12V; CREATE_NAME: Nathan; DIP&SMD: SMD; SAP: T670200014500; MFG: JINGJU; Vendor Code: *; Vendor Name: *; Value: TACT; Type: Switch; CREATE_TIME: 07-May-2019; Customer Specific: N/A
U4 = STM32F030RCT6TR: MCU STM32F030RCT6TR LQFP64 ST K; MFG: ST     (STM意法半導體); CREATE_NAME: Nathan; DIP&SMD: SMD; SAP: T610300097225; Type: IC; CREATE_TIME: 02-NOV-2017; Customer Specific: N/A

## Sheet Main board frame.SchDoc
size A4; Organization: Altium Limited; Address1: L3, 12a Rodborough Rd; Address2: Frenchs Forest; Address3: NSW; Address4: Australia 2086; SheetNumber: 5; SheetTotal: 6

### Notes on the sheet
- Author
- Title
- Size:
- Date:
- A4
- Number:
- Time:
- Revision:
- Sheet
- of
- Radio Flyer inc
- West Chicago
- File:
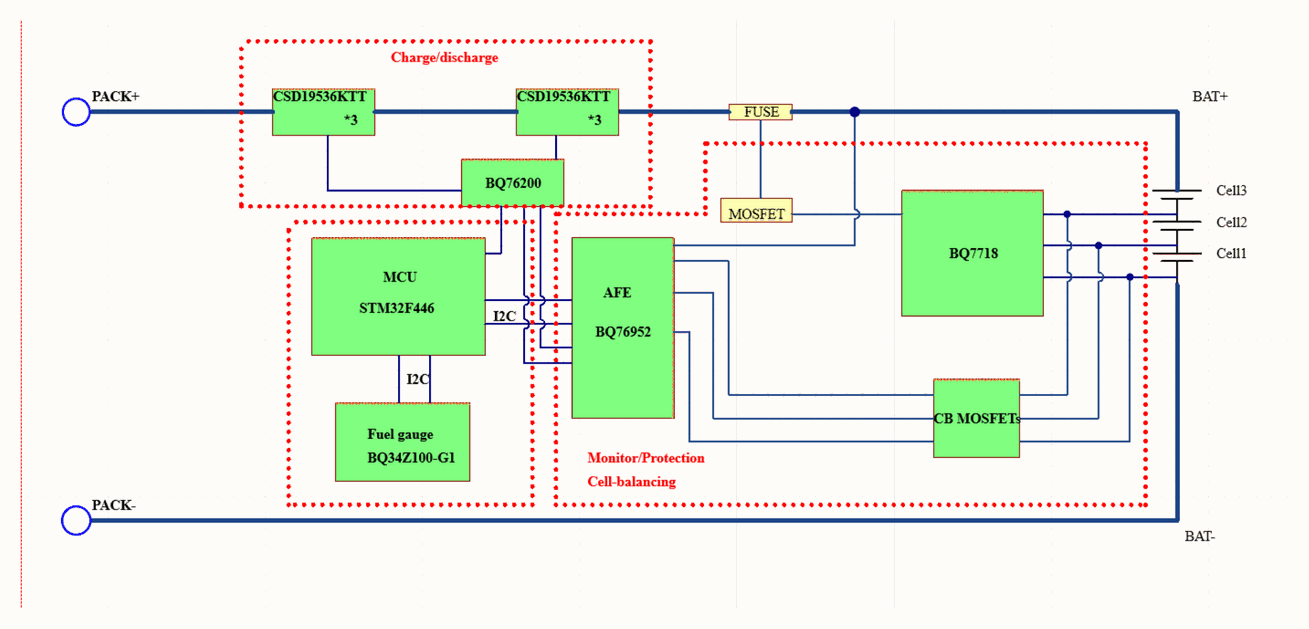
[diagram p4: Main board frame.SchDoc]

## Nets that join several sheets
3.3V: Overview (8 pins), Control and gauge (18 pins)
BAT+: Overview (9 pins), Secondary protection (R32.2 R34.2), Cell monitoring and balancing (R17.1 R18.1)
GND: Overview (27 pins), Secondary protection (C30.2 C33.2 U5.0 U5.7), Cell monitoring and balancing (19 pins), Control and gauge (17 pins)
CD: Overview (6 pins), Cell monitoring and balancing (Q8.3)
FUSE: Overview (C6.1 J1.2 Q5.1 R9.1), Secondary protection (R33.1)
LD: Overview (R1.2), Cell monitoring and balancing (U3.41)
NetC9_1: Overview (C9.1 C10.1 R15.2), Cell monitoring and balancing (U3.20)
NetC9_2: Overview (C9.2 C10.2 R14.2), Cell monitoring and balancing (U3.18)
NetJ1_1: Overview (J1.1), Cell monitoring and balancing (U3.38)
NetJ2_2: Overview (J2.2), Control and gauge (U4.37)
NetJ2_3: Overview (J2.3), Control and gauge (U4.38)
NetJ3_2: Overview (J3.2), Secondary protection (R36.2), Cell monitoring and balancing (R21.1)
NetJ3_3: Overview (J3.3), Secondary protection (R35.2), Cell monitoring and balancing (R19.1)
NetJ4_2: Overview (J4.2), Control and gauge (U4.53)
NetJ4_3: Overview (J4.3), Control and gauge (U4.52)
NetJ4_4: Overview (J4.4), Control and gauge (U4.51)
NetJ5_2: Overview (J5.2), Control and gauge (U4.43)
NetJ5_3: Overview (J5.3), Control and gauge (U4.42)
NetJ6_2: Overview (J6.2), Control and gauge (U4.17)
NetJ6_3: Overview (J6.3), Control and gauge (U4.16)
NetJ7_2: Overview (J7.2), Control and gauge (U4.9)
NetJ7_3: Overview (J7.3), Control and gauge (U4.34)
NetJ7_4: Overview (J7.4), Control and gauge (U4.10)
NetR3_2: Overview (R3.2 R5.2 R12.2), Cell monitoring and balancing (U3.45)
NetR4_1: Overview (R4.1 R6.1 R13.1), Cell monitoring and balancing (U3.43)
NetR29_2: Cell monitoring and balancing (U3.26), Control and gauge (R29.2 U4.58)
NetR30_2: Cell monitoring and balancing (U3.27), Control and gauge (R30.2 U4.59)
PACK_SENSE: Overview (R2.2), Cell monitoring and balancing (U3.42)